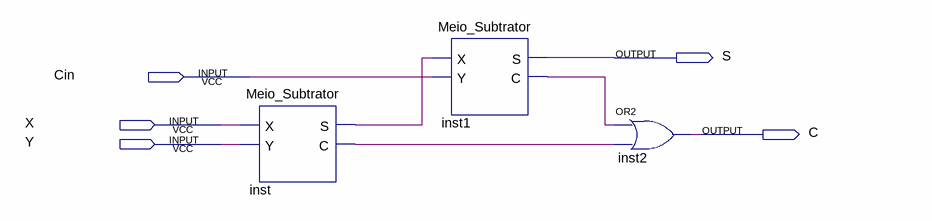
[diagram p0: schematic sheet]
// Quartus schematic Subtrator_Completo.bdf as structural Verilog: 3 symbols, 5 pins
module Subtrator_Completo (
  input  Cin,
  input  X,
  input  Y,
  output S,
  output C
);

  wire inst1_c, inst_c, inst_s;

  Meio_Subtrator inst (.X(X), .Y(Y), .S(inst_s), .C(inst_c));
  Meio_Subtrator inst1 (.X(inst_s), .Y(Cin), .S(S), .C(inst1_c));
  or inst2 (C, inst1_c, inst_c);
endmodule
